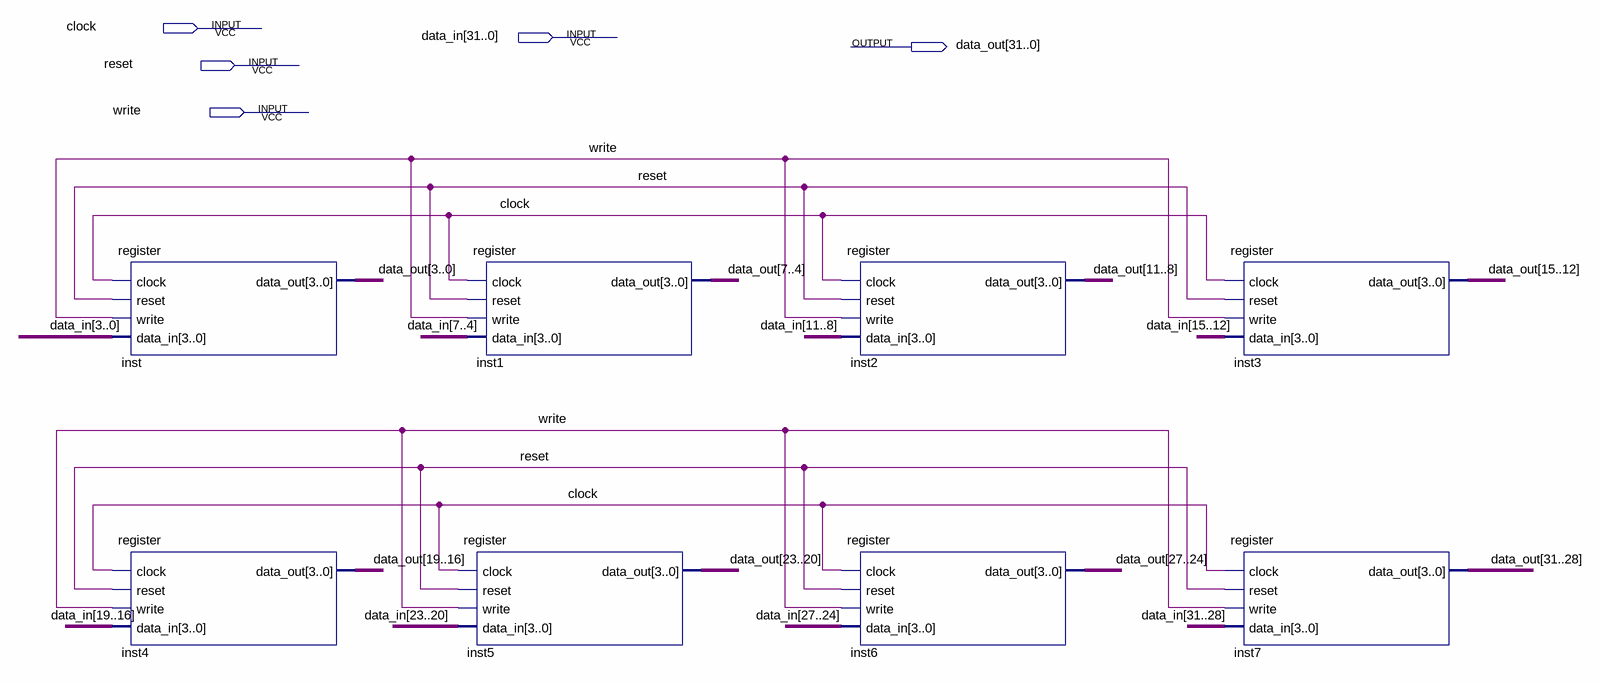
[diagram p0: schematic sheet]
// Quartus schematic register32.bdf as structural Verilog: 8 symbols, 5 pins
module register32 (
  input  clock,
  input  [31:0] data_in,
  input  reset,
  input  write,
  output [31:0] data_out
);

  register inst (.clock(clock), .reset(reset), .write(write), .data_in(data_in[3:0]), .data_out(data_out[3:0]));
  register inst4 (.clock(clock), .reset(reset), .write(write), .data_in(data_in[19:16]), .data_out(data_out[19:16]));
  register inst1 (.clock(clock), .reset(reset), .write(write), .data_in(data_in[7:4]), .data_out(data_out[7:4]));
  register inst5 (.clock(clock), .reset(reset), .write(write), .data_in(data_in[23:20]), .data_out(data_out[23:20]));
  register inst2 (.clock(clock), .reset(reset), .write(write), .data_in(data_in[11:8]), .data_out(data_out[11:8]));
  register inst6 (.clock(clock), .reset(reset), .write(write), .data_in(data_in[27:24]), .data_out(data_out[27:24]));
  register inst3 (.clock(clock), .reset(reset), .write(write), .data_in(data_in[15:12]), .data_out(data_out[15:12]));
  register inst7 (.clock(clock), .reset(reset), .write(write), .data_in(data_in[31:28]), .data_out(data_out[31:28]));
endmodule
